# Altium schematic sheet dh.SchDoc
size A
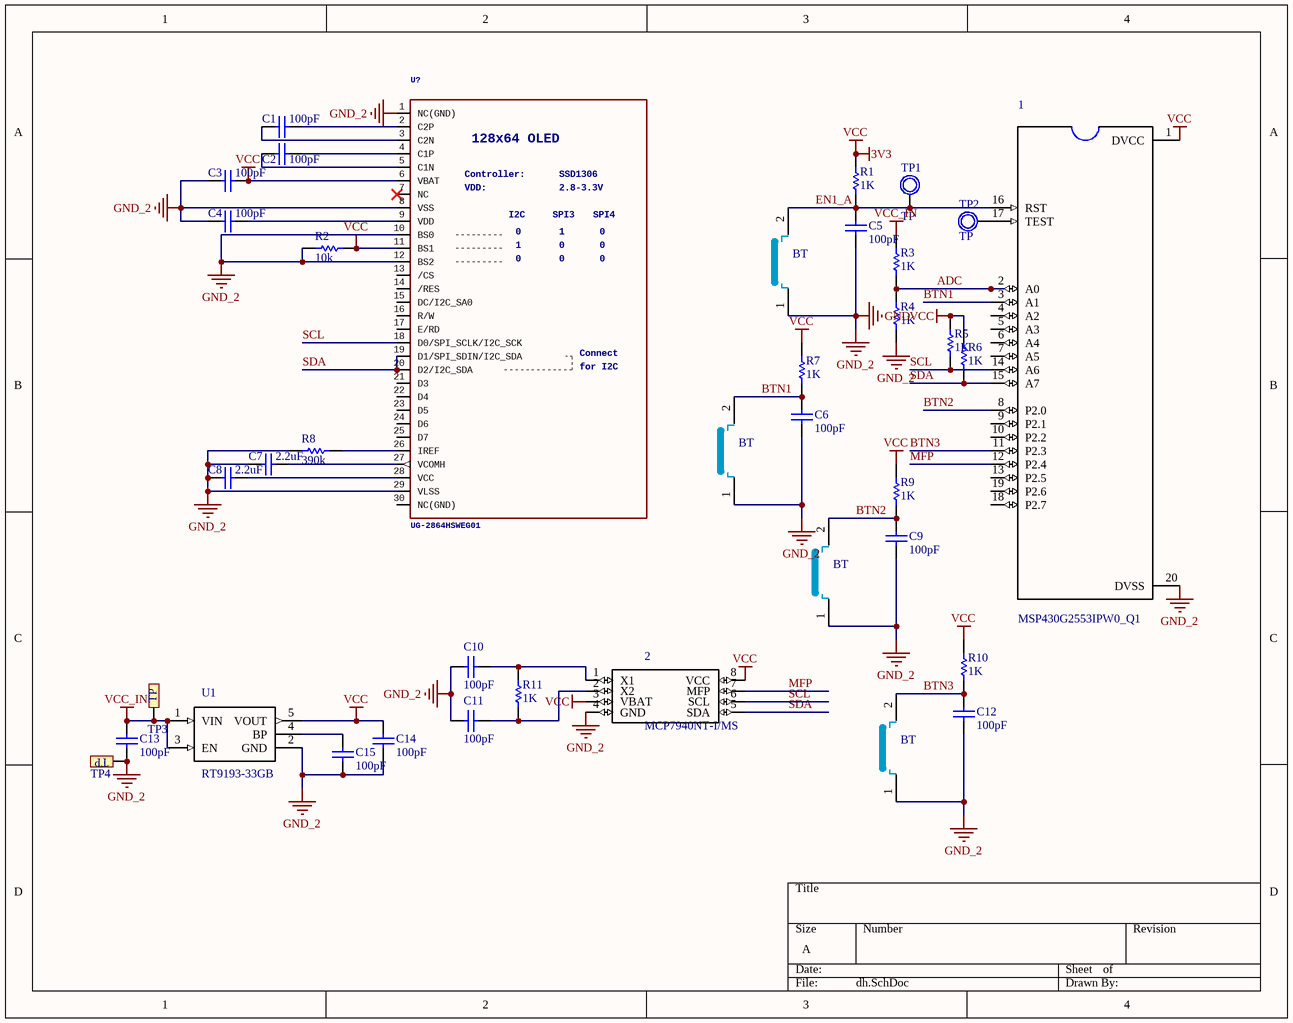
[diagram p0: dh.SchDoc]

## Parts
1  MSP430G2553IPW0_Q1  [*TSSOP-20]
2  MCP7940NT-I/MS  [*SOP65P640X120-8N]
BT1  BT  [SW-SMD]
BT2  BT  [SW-SMD]
BT3  BT  [SW-SMD]
BT4  BT  [SW-SMD]
C1  value 100pF  [CAP-SM-0603]  (hidden comment: Cap Non-Pol SMD)
C2  value 100pF  [CAP-SM-0603]  (hidden comment: Cap Non-Pol SMD)
C3  value 100pF  [CAP-SM-0603]  (hidden comment: Cap Non-Pol SMD)
C4  value 100pF  [CAP-SM-0603]  (hidden comment: Cap Non-Pol SMD)
C5  value 100pF  [CAP-SM-0603]  (hidden comment: Cap Non-Pol SMD)
C6  value 100pF  [CAP-SM-0603]  (hidden comment: Cap Non-Pol SMD)
C7  value 2.2uF  [CAP-SM-0603]  (hidden comment: Cap Non-Pol SMD)
C8  value 2.2uF  [CAP-SM-0603]  (hidden comment: Cap Non-Pol SMD)
C9  value 100pF  [CAP-SM-0603]  (hidden comment: Cap Non-Pol SMD)
C10  value 100pF  [CAP-SM-0603]  (hidden comment: Cap Non-Pol SMD)
C11  value 100pF  [CAP-SM-0603]  (hidden comment: Cap Non-Pol SMD)
C12  value 100pF  [CAP-SM-0603]  (hidden comment: Cap Non-Pol SMD)
C13  value 100pF  [CAP-SM-0603]  (hidden comment: Cap Non-Pol SMD)
C14  value 100pF  [CAP-SM-0603]  (hidden comment: Cap Non-Pol SMD)
C15  value 100pF  [CAP-SM-0603]  (hidden comment: Cap Non-Pol SMD)
R1  value 1K  [RES-SM-0603]  (hidden comment: RESISTOR SMD)
R2  value 10k  [RES-SM-0603]  (hidden comment: RESISTOR SMD)
R3  value 1K  [RES-SM-0603]  (hidden comment: RESISTOR SMD)
R4  value 1K  [RES-SM-0603]  (hidden comment: RESISTOR SMD)
R5  value 1K  [RES-SM-0603]  (hidden comment: RESISTOR SMD)
R6  value 1K  [RES-SM-0603]  (hidden comment: RESISTOR SMD)
R7  value 1K  [RES-SM-0603]  (hidden comment: RESISTOR SMD)
R8  value 390k  [RES-SM-0603]  (hidden comment: RESISTOR SMD)
R9  value 1K  [RES-SM-0603]  (hidden comment: RESISTOR SMD)
R10  value 1K  [RES-SM-0603]  (hidden comment: RESISTOR SMD)
R11  value 1K  [RES-SM-0603]  (hidden comment: RESISTOR SMD)
TP1  TP  [TP1]
TP2  TP  [TP1]
TP3  Test Point  [TP]  (value not drawn)
TP4  Test Point  [TP]  (value not drawn)
U1  RT9193-33GB  [*SOT94P279X129-5N]
U?  UG-2864HSWEG01  128x64OLED: 128x64 OLED  forI2C: for I2C  Controller: Controller:  VDD: VDD:  [my_footprint]

## Nets
3V3: 1.1(DVCC) 2.3(VBAT) 2.8(VCC) C3.2 C14.2 R1.2 R2.2 R5.2 R6.2 R7.2 R9.2 R10.2 U1.5(VOUT) U?.6(VBAT) U?.11(BS1)  [also labelled VCC]
GND: 1.20(DVSS) 2.4(GND) BT1.1 BT2.1 BT3.1 BT4.1 C3.1 C4.1 C5.1 C6.1 C7.1 C8.1 C9.1 C10.1 C11.1 C12.1 C13.1 C14.1 C15.1 R2.1 R4.1 R8.1 TP4.TP1 U1.2(GND) U?.1(NC(GND)) U?.8(VSS) U?.10(BS0) U?.12(BS2) U?.29(VLSS)  [also labelled GND_2]
VCC_IN: C13.2 R3.2 TP3.TP1 U1.1(VIN) U1.3(EN)
ADC: 1.2(A0) R3.1 R4.2
BTN1: 1.3(A1) BT2.2 C6.2 R7.1
BTN2: 1.8(P2.0) BT3.2 C9.2 R9.1
BTN3: 1.11(P2.3) BT4.2 C12.2 R10.1
EN1_A: 1.16(RST) BT1.2 C5.2 R1.1 TP1.1
MFP: 1.12(P2.4) 2.7(MFP)
SCL: 1.14(A6) 2.6(SCL) R5.1 U?.18(D0/SPI_SCLK/I2C_SCK)
SDA: 1.15(A7) 2.5(SDA) R6.1 U?.19(D1/SPI_SDIN/I2C_SDA) U?.20(D2/I2C_SDA)
Net1_17: 1.17(TEST) TP2.1
Net2_1: 2.1(X1) C10.2 R11.2
Net2_2: 2.2(X2) C11.2 R11.1
NetC1_1: C1.1 U?.3(C2N)
NetC1_2: C1.2 U?.2(C2P)
NetC2_1: C2.1 U?.5(C1N)
NetC2_2: C2.2 U?.4(C1P)
NetC4_2: C4.2 U?.9(VDD)
NetC7_2: C7.2 U?.27(VCOMH)
NetC8_2: C8.2 U?.28(VCC)
NetC15_2: C15.2 U1.4(BP)
NetR8_2: R8.2 U?.26(IREF)

Not connected (* = marked no-connect by the designer): 1 4(A2) 5(A3) 6(A4) 7(A5) 9(P2.1) 10(P2.2) 13(P2.5) 18(P2.7) 19(P2.6); U? 7(NC)* 13(/CS) 14(/RES) 15(DC/I2C_SA0) 16(R/W) 17(E/RD) 21(D3) 22(D4) 23(D5) 24(D6) 25(D7) 30(NC(GND))

## Notes on the sheet
- (in symbol Test Point) TP

## Library data of the parts
1 = MSP430G2553IPW0_Q1: MSP430? Ultra-Low-Power Microcontrollers for Automotive Applications 20-TSSOP -40 to 85; MP: MSP430G2553IPW0 Q1; MF: Texas Instruments; Price: None; Availability: Unavailable; Package: TSSOP-20 Texas Instruments; SnapEDA_Link: https://www.snapeda.com/parts/MSP430G2553IPW0%20Q1/Texas%20Instruments/view-part/?ref=snap; Value: *
2 = MCP7940NT-I/MS: Real Time Clock Serial 64Byte 8-Pin MSOP T/R; MF: Microchip; Price: None; Availability: Unavailable; MP: MCP7940NT-I/MS; Package: MSOP-8 Microchip; SnapEDA_Link: https://www.snapeda.com/parts/MCP7940NT-I/MS/Microchip/view-part/?ref=snap; Value: *
BT1-BT4 = BUTTON
C1-C15 = Cap Non-Pol SMD: Capacitor
R1-R11 = RESISTOR SMD: Resistor
TP1 TP2 = TP1: Test Point; Value: Test Point
U1 = RT9193-33GB: RT9193 Series 300 mA 3.3 V Ultra-Low Noise Ultra-Fast CMOS LDO Regulator-SC-70-5; MF: Richtek USA; MP: RT9193-33GB; Package: SOT-23-5 Richtek; Availability: Unavailable; Price: None; SnapEDA_Link: https://www.snapeda.com/parts/RT9193-33GB/Richtek%20USA%20Inc./view-part/?ref=snap; Value: *
U? = DISP_OLED_UG-2864HSWEG010.96": UG-2864HSWEG01 OLED display Both 1.3" and 0.96" models share the same FPC tab footprint, only the screen dimensions vary.; GateName_1: G$1; SymbolName_1: UG-2864HSWEG01; DeviceName: 0.96"; LibraryName: microbuilder; DeviceSetName: DISP_OLED_UG-2864HSWEG01; I2C: I2C; SPI3: SPI3; 0: 0; 1: 1; Connect: Connect; SSD1306: SSD1306; 2.8-3.3V: 2.8-3.3V; SPI4: SPI4